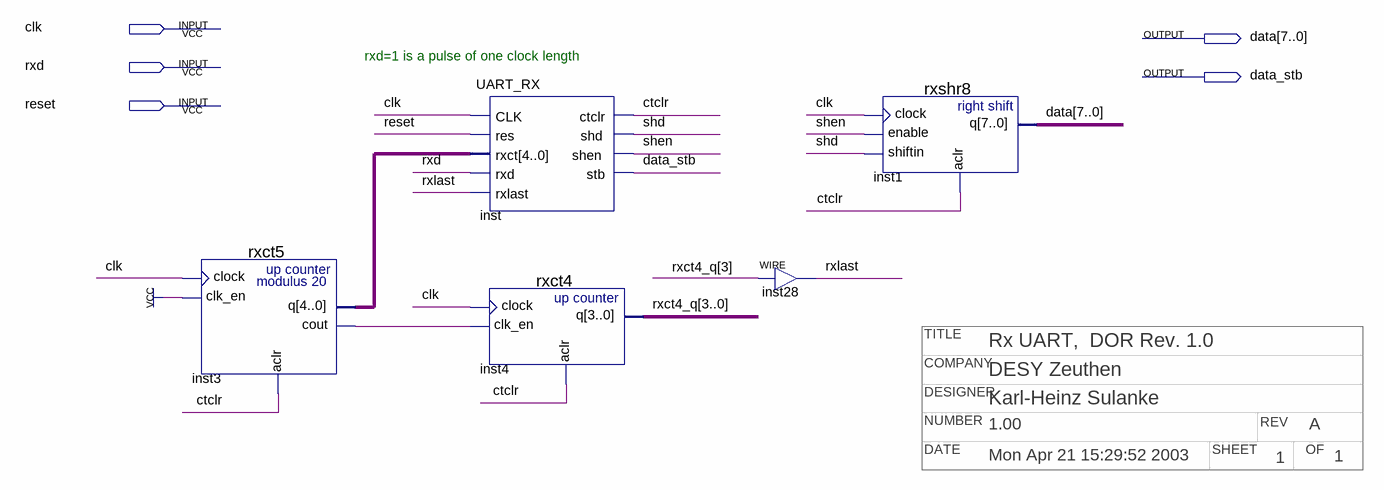
[diagram p0: schematic sheet]
// Quartus schematic RX_UART_10.bdf as structural Verilog: 5 symbols, 5 pins
// Title block: TITLE: Rx UART,  DOR Rev. 1.0; COMPANY: DESY Zeuthen; DESIGNER: Karl-Heinz Sulanke; NUMBER: 1.00; REV: A; DATE: Mon Apr 21 15:29:52 2003; SHEET: 1; OF: 1
module RX_UART_10 (
  input  clk,
  input  rxd,
  input  reset,
  output [7:0] data,
  output data_stb
);

  wire ctclr, inst3_cout, rxlast, shd, shen;
  wire [3:0] rxct4_q;
  wire [4:0] inst3_q;

  rxct5 inst3 (.clock(clk), .clk_en(1'b1), .aclr(ctclr), .q(inst3_q), .cout(inst3_cout));
  UART_RX inst (
    .CLK(clk), .res(reset), .rxct(inst3_q), .rxd(rxd), .rxlast(rxlast), .ctclr(ctclr), .shd(shd),
    .shen(shen), .stb(data_stb));
  rxct4 inst4 (.clock(clk), .clk_en(inst3_cout), .aclr(ctclr), .q(rxct4_q));
  assign rxlast = rxct4_q[3];  // WIRE inst28
  rxshr8 inst1 (.clock(clk), .enable(shen), .shiftin(shd), .aclr(ctclr), .q(data));

  // Notes on the sheet:
  //   rxd=1 is a pulse of one clock length
endmodule
